# EAGLE design MiniShieldMWC (EAGLE 7.3.0)
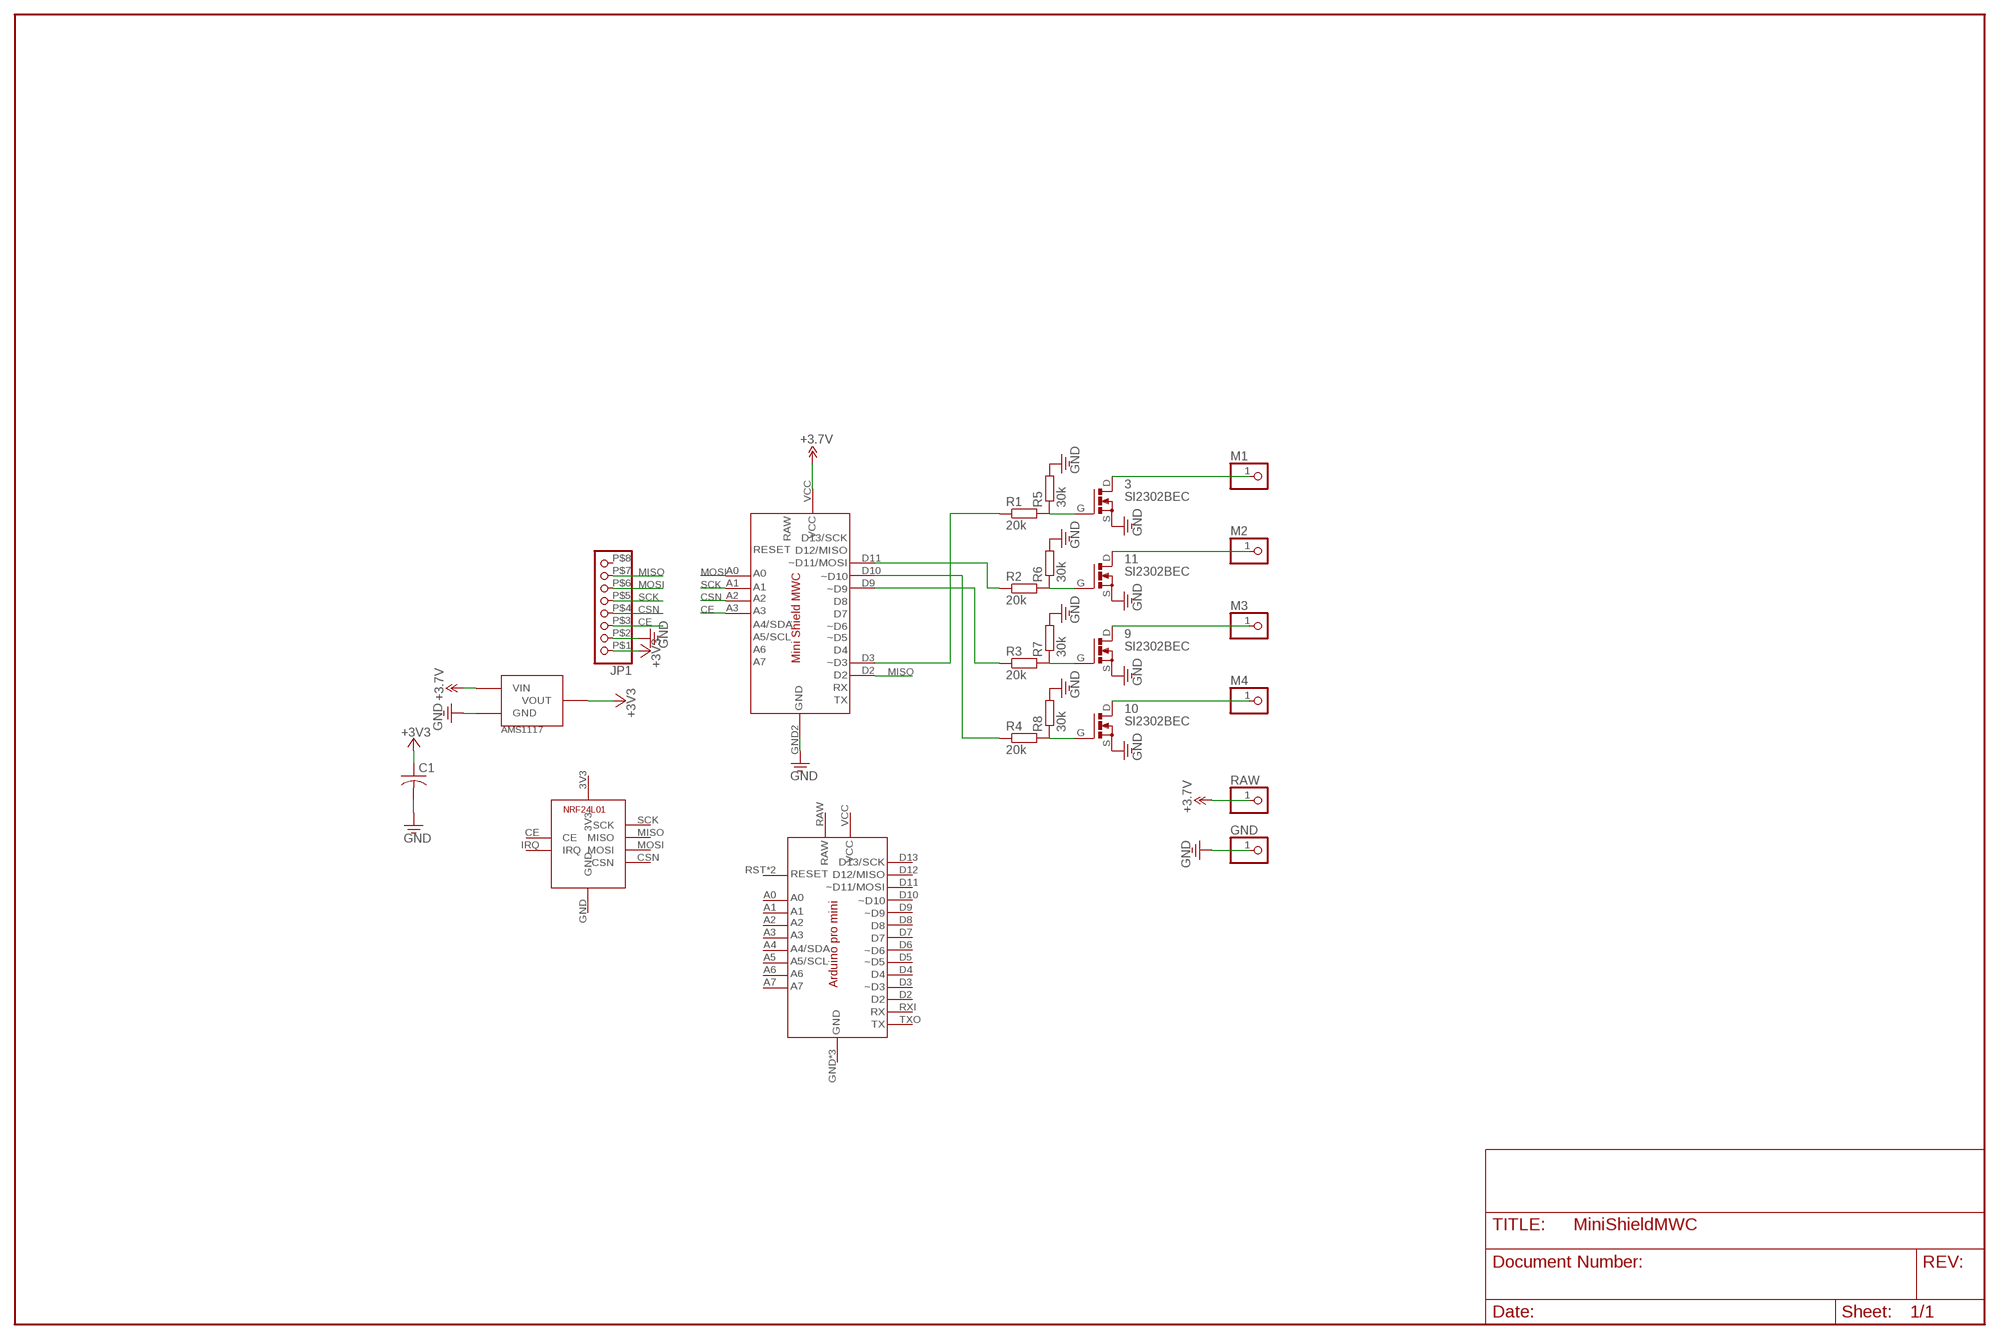
[diagram p0: schematic, sheet 1]

## Parts
3  SI2302BEC  [SOT23-BEC]
9  SI2302BEC  [SOT23-BEC]
10  SI2302BEC  [SOT23-BEC]
11  SI2302BEC  [SOT23-BEC]
C1  C-USC0805  [C0805]
GND  PINHD-1X1  [1X01]
JP1  PINHD-1X8MINI  [PINHD_MINI_X8]
M1  PINHD-1X1  [1X01]
M2  PINHD-1X1  [1X01]
M3  PINHD-1X1  [1X01]
M4  PINHD-1X1  [1X01]
R1  20k  R-EU_M0805  [M0805]
R2  20k  R-EU_M0805  [M0805]
R3  20k  R-EU_M0805  [M0805]
R4  20k  R-EU_M0805  [M0805]
R5  30k  R-EU_M0805  [M0805]
R6  30k  R-EU_M0805  [M0805]
R7  30k  R-EU_M0805  [M0805]
R8  30k  R-EU_M0805  [M0805]
RAW  PINHD-1X1  [1X01]
U$1  ARDUINO_PRO_MINI  [ARDUINO_PRO_MINI]
U$2  NRF24L01MINI  [NRF24L01_MINI]
U$3  AMS1117  [AMS1117]
U$4  MINI_SHIELD_MWC  [MINI_SHIELD_MWC]

## Nets
+3V3: C1.1 JP1.P$1 U$3.VOUT U$3.VOUT1(VOUT)
CE: JP1.P$3 U$4.A3
CSN: JP1.P$4 U$4.A2
GND: 3.S 9.S 10.S 11.S C1.2 GND.1 JP1.P$2 R5.2 R6.2 R7.2 R8.2 U$3.GND U$4.GND2(GND)
MISO: JP1.P$7 U$4.D2
MOSI: JP1.P$6 U$4.A0
N$1: 3.G R1.2 R5.1
N$2: 11.G R2.2 R6.1
N$3: 9.G R3.2 R7.1
N$4: 10.G R4.2 R8.1
N$5: R1.1 U$4.D3(~D3)
N$6: R2.1 U$4.D11(~D11)
N$7: R3.1 U$4.D9(~D9)
N$8: R4.1 U$4.D10(~D10)
N$9: 10.D M4.1
N$10: 9.D M3.1
N$11: 11.D M2.1
N$12: 3.D M1.1
N$19: RAW.1 U$3.VIN U$4.VCC ; supply symbol labelled +3.7V
SCK: JP1.P$5 U$4.A1
Unconnected: JP1.P$8 U$1.A0 U$1.A1 U$1.A2 U$1.A3 U$1.A4 U$1.A5 U$1.A6 U$1.A7 U$1.D2 U$1.D3(~D3) U$1.D4 U$1.D5(~D5) U$1.D6(~D6) U$1.D7 U$1.D8 U$1.D9(~D9) U$1.D10(~D10) U$1.D11(~D11) U$1.D12 U$1.D13 U$1.RST1(RESET) U$1.RST(RESET) U$1.RXI U$1.TXO U$2.CE U$2.CSN U$2.IRQ U$2.MISO U$2.MOSI U$2.SCK

## Power pins joined to a net without a drawn wire
3V3: U$2.3V3
GND: U$1.GND U$1.GND1(GND) U$1.GND2(GND) U$2.GND
RAW: U$1.RAW
VCC: U$1.VCC

## Library data of the parts
3 9-11 = myParts:SI2302: N-CHANNEL MOS FET SYMBOL
C1 = resistor:C-US: CAPACITOR, American symbol
GND M1-M4 RAW = myParts:PINHD-1X1: PIN HEADER
JP1 = myParts:PINHD-1X8: PIN HEADER
R1-R8 = myParts:R-EU_: RESISTOR, European symbol
U$1 = myParts:ARDUINO_PRO_MINI
U$2 = myParts:NRF24L01
U$3 = myParts:AMS1117
U$4 = myParts:MINI_SHIELD_MWC

## Board
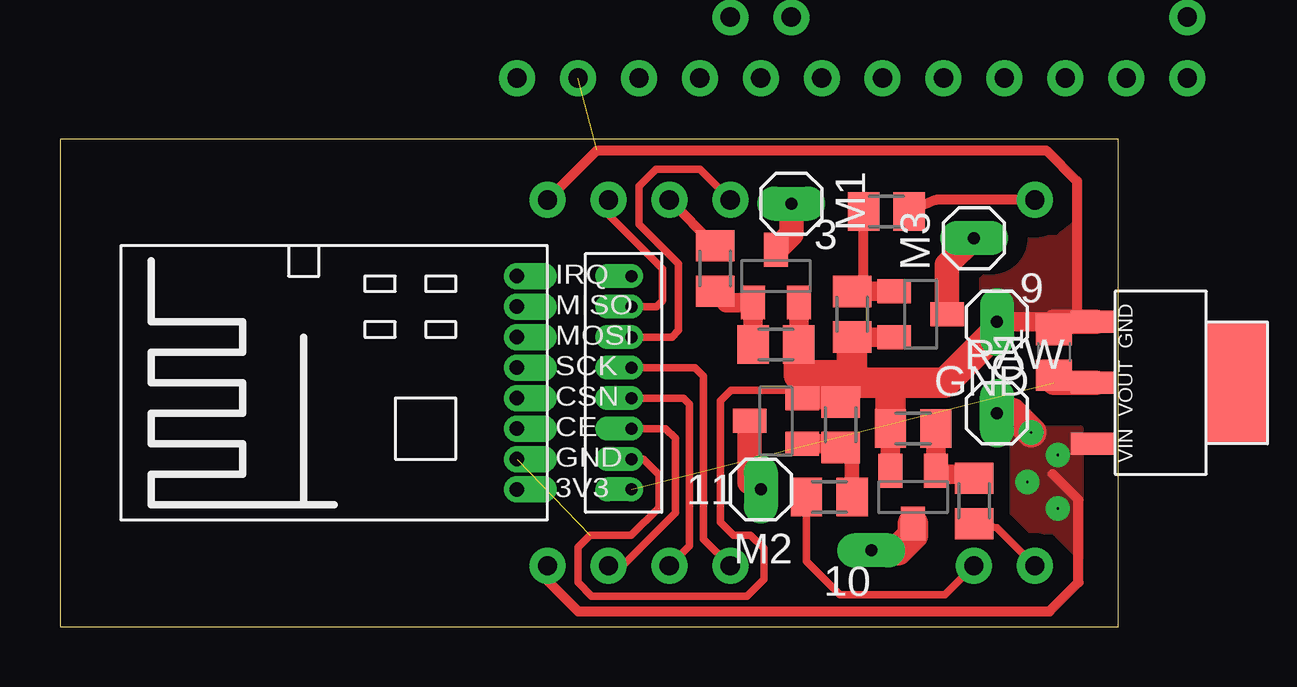
[diagram p1: board, top side]
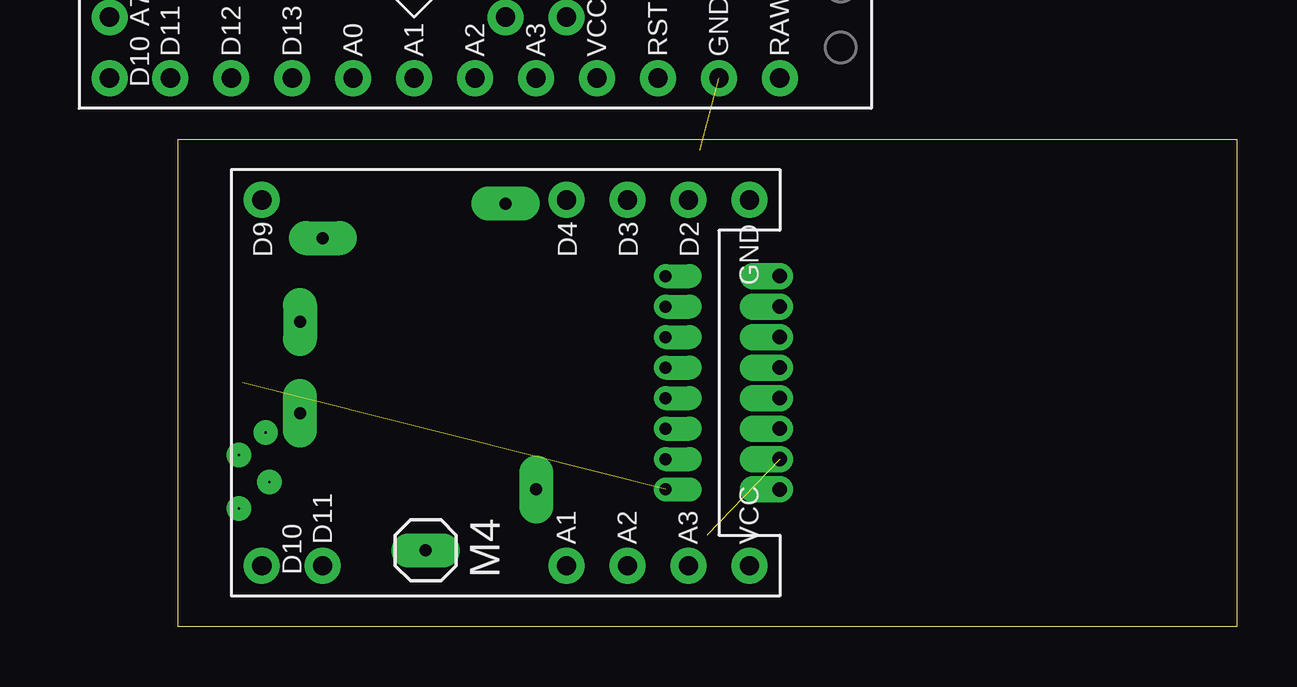
[diagram p2: board, bottom side, seen from below]

Size 44.12 x 20.31 mm. Coordinates in mm from the lower left corner, seen from the top.
Outline: 0,0 44.12,0 44.12,20.31 0,20.31 0,0
Copper layers (1*16): Top 0.035mm / dielectric 1.5mm / Bottom 0.035mm
Design rules "default *": minimum track width 10mil, minimum drill 24mil, track to track 8mil, track to pad 8mil, pad to pad 8mil, via to via 8mil, smd to smd 8mil, copper to edge 40mil, drill to drill 8mil, minimum pad ring 10mil, minimum via ring 8mil, stop-mask expansion 4mil, vias tented up to drill 0mil, thermal gap 0mil

### Footprints (pad centres in the part's own frame; a part is rotated, then mirrored left to right if it is on the bottom)
SOT23-BEC = smd 1 x 1.4: D 0,1.1; G -0.95,-1.1; S 0.95,-1.1
C0805 = smd 1.3 x 1.5: 1 -0.95,0; 2 0.95,0
1X01 = drill 0.5 pad 1.422 long: 1 0,0
PINHD_MINI_X8 = drill 0.5 pad 0.965 offset: P$1 0,0; P$2 0,1.27; P$3 0,2.54; P$4 0,3.81; P$5 0,5.08; P$6 0,6.35; P$7 0,7.62; P$8 0,8.89
M0805 = smd 1.3 x 1.6: 1 -0.95,0; 2 0.95,0
ARDUINO_PRO_MINI = drill 0.8 pad 1.5: A0 -2.54,-7.62; A1 0,-7.62; A2 2.54,-7.62; A3 5.08,-7.62; A4 3.81,-5.08; A5 6.35,-5.08; A6 -12.7,-2.54; A7 -12.7,-5.08; D2 5.08,7.62; D3 2.54,7.62; D4 0,7.62; D5 -2.54,7.62; D6 -5.08,7.62; D7 -7.62,7.62; D8 -10.16,7.62; D9 -12.7,7.62; D10 -12.7,-7.62; D11 -10.16,-7.62; D12 -7.62,-7.62; D13 -5.08,-7.62; GND 7.62,7.62; GND1 12.7,-7.62; GND2 -12.7,0; RAW 15.24,-7.62; RST 10.16,7.62; RST1 10.16,-7.62; RXI 12.7,7.62; TXO 15.24,7.62; VCC 7.62,-7.62
NRF24L01_MINI = drill 0.6 pad 1.016 offset: 3V3 -3.81,-6.35; CE -1.27,-6.35; CSN 0,-6.35; GND -2.54,-6.35; IRQ 5.08,-6.35; MISO 3.81,-6.35; MOSI 2.54,-6.35; SCK 1.27,-6.35
AMS1117 = smd 0.914 x 1.778: GND -2.54,-0.953; VIN 2.54,-0.953; VOUT 0,-0.953 | smd 5.08 x 2.54: VOUT1 0,5.08
MINI_SHIELD_MWC = drill 0.8 pad 1.5: A0 2.54,7.62; A1 2.54,-7.62; A2 0,-7.62; A3 -2.54,-7.62; D2 -2.54,7.62; D3 0,7.62; D9 15.24,7.62; D10 15.24,-7.62; D11 12.7,-7.62; GND2 -5.08,7.62; VCC -5.08,-7.62

### Placement (x,y rotation side)
3  29.84,14.61 0 top
9  35.88,13.02 270 top
10  35.56,5.4 180 top
11  29.84,8.57 90 top
C1  41.43,11.43 90 top
GND  39.05,12.7 180 top
JP1  23.81,5.71 0 top
M1  30.48,17.62 270 top
M2  29.21,5.71 180 top
M3  38.1,16.19 90 top
M4  33.81,3.17 270 bottom
R1  27.3,14.92 270 top
R2  32.07,5.4 0 top
R3  34.45,17.3 180 top
R4  38.1,5.24 90 top
R5  29.84,11.75 0 top
R6  32.54,8.41 90 top
R7  33.02,13.02 270 top
R8  35.56,8.26 180 top
RAW  39.05,8.89 0 top
U$1  34.29,30.48 0 bottom
U$2  12.7,9.53 90 top
U$3  43.97,10.16 270 top
U$4  25.4,10.16 0 top

### Tracks (layer width: path | path; a pad name or v marks a point on that pad's centre or on a via)
+3V3  (1 unrouted)
  Top 1.016: C1.1 41.43,10.16 U$3.VOUT 43.18,10.16
CE
  Top 0.305: JP1.P$3 25.25,8.26 25.65,7.85 25.65,4.74 24.71,3.81 23.45,2.54 U$4.A3
CSN
  Top 0.305: JP1.P$4 25.98,9.53 26.24,9.27 26.24,3.38 U$4.A2
GND  (2 unrouted)
  Top 0.305: 11.S 30.63,9.84 27.96,9.84 27.53,9.41 27.53,4.36 28.08,3.81 28.79,3.81 29.33,3.27 29.33,1.97 28.63,1.27 22.16,1.27 21.59,1.84 21.59,3.31 22.09,3.81 23.81,3.81 24.96,4.96 24.96,6.34 24.32,6.99 JP1.P$2
  Top 0.406: U$3.GND 42.41,12.7 | U$4.GND2 22.38,19.84 41.11,19.84 42.39,18.56 42.39,12.7 41.91,12.7
  Top 0.813: R8.2 10.S | R6.2 11.S | 3.S 30.8,12.07 R5.2 | R7.2 9.S | 41.43,12.7 GND.1
  Top 1.016: C1.2 41.43,12.7 41.91,12.7 U$3.GND 43.18,12.7
  Top 1.27: 32.38,10.16 R6.2 | 32.38,10.16 33.02,10.16 | 33.02,10.16 R7.2 | 30.8,12.07 30.8,10.48 32.38,10.48 32.38,10.16 | GND.1 39.05,12.32 36.89,10.16 34.61,10.16 | 34.61,10.16 33.02,10.16 | R8.2 34.61,10.16
  pour Top (isolate 0.813): 38.42,16.19 38.42,12.7 42.39,12.7 42.39,16.83 41.75,16.35 41.59,16.19
MISO
  Top 0.305: JP1.P$7 24.86,13.34 25.11,13.58 25.11,14.92 22.86,17.16 U$4.D2
MOSI
  Top 0.305: U$4.A0 26.67,19.05 24.84,19.05 24.13,18.34 24.13,16.77 25.79,15.11 25.79,12.35 25.51,12.06 JP1.P$6
N$1
  Top 0.813: 28.89,11.43 R5.1 3.G 27.77,13.51 R1.2
N$2
  Top 0.406: 32.38,7.62 32.86,7.62
  Top 0.61: R2.2 33.02,7.62 32.54,7.62 R6.1
  Top 0.813: 11.G 32.38,7.62 R6.1
N$3
  Top 0.406: R7.1 33.5,13.97 R3.2
  Top 0.813: R7.1 9.G
N$4
  Top 0.813: R8.1 10.G 36.51,6.35 | 36.51,6.35 | 36.51,6.35 38.1,6.35 R4.2
N$5
  Top 0.406: R1.1 U$4.D3
N$6
  Top 0.305: U$4.D11 36.89,1.33 32.51,1.33 31.12,2.72 R2.1
N$7
  Top 0.406: U$4.D9 36.51,17.78 R3.1
N$8
  Top 0.305: R4.1 39.05,4.13 U$4.D10
N$9
  Top 1.27: 10.D 35.56,3.81 34.92,3.17 M4.1
N$10
  Top 1.016: 9.D 36.98,15.07 M3.1
N$11
  Top 1.016: 11.D 28.75,6.02 M2.1
N$12
  Top 1.016: 3.D 30.48,16.34 M1.1
N$19  (via drill 0.1 pad 1.02)
  Top 0.406: 41.38,6.35 42.45,5.28 42.45,1.84 41.24,0.64 21.6,0.64 20.32,1.92 U$4.VCC
  Top 1.27: RAW.1 39.69,8.89 v40.48,8.1
  other vias: 41.59,4.92 40.32,6.03 41.59,7.14
  pour Top (isolate 0.61): 39.69,8.73 39.69,4.76 40.48,3.97 41.43,3.97 42.55,2.86 42.55,8.26 40.32,8.26
SCK
  Top 0.305: JP1.P$5 26.47,10.79 26.83,10.44 26.83,3.65 U$4.A1